# EasyEDA Pro project grandPA2.eprj, schematic Key
Board Name: Key; Create Date: 2026-07-15; Page Name: P1; Project Name: grandPA2; Schematic Name: Key; Update Date: 2026-07-20; Company: EasyEDA.com; Page Size: A4; Version: v0.2
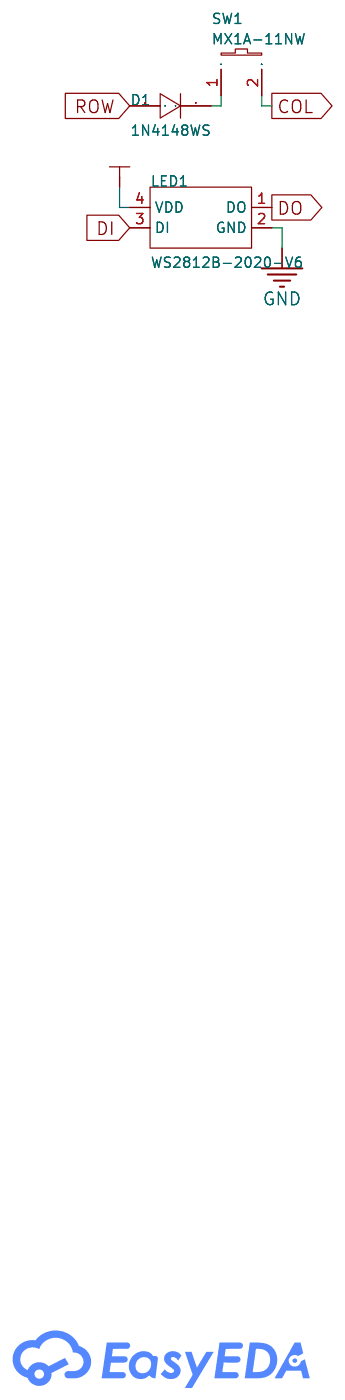
[diagram p1: schematic sheet]

## Parts
D1  1N4148WS  [SOD-323_L1.8-W1.3-LS2.5-RD]
LED1  WS2812B-2020-V6  [LED-SMD_4P-L2.2-W2.0-P1.00_WS2815C-2020-4P]
SW1  MX1A-11NW  [SW-TH_MX1A-11NW]

## Library data of the parts
D1 = 1N4148WS_C2128: LCSC Part Name: 丝印T4 100V 150mA; Supplier Part: C2128; Manufacturer: CJ(江苏长电/长晶); Supplier Footprint: SOD-323; JLCPCB Part Class: Basic Part; Datasheet: https://item.szlcsc.com/datasheet/1N4148WS/2485.html; Supplier: LCSC; Diode Configuration: Standalone; Pd - Power Dissipation: 200mW; Current - Rectified: 150mA; Voltage - DC Reverse(Vr): 100V; Voltage - Forward(Vf@If): 1.25V@150mA; Non-Repetitive Peak Forward Surge Current: 2A; Reverse Leakage Current (Ir): 1uA@75V; Reverse Recovery Time (trr): 4ns
LED1 = WS2812B-2020-V6: Supplier Part: C52917434; Manufacturer: worldsemi; Supplier Footprint: SMD2020-4P; JLCPCB Part Class: Extended Part; Datasheet: https://item.szlcsc.com/datasheet/WS2812B-2020-V6/55827425.html; Supplier: LCSC
SW1 = MX1A-11NW: Supplier Part: C3316924; Manufacturer: CHERRY; JLCPCB Part Class: Extended Part; Datasheet: https://item.szlcsc.com/datasheet/MX1A-11NW/3881518.html; Supplier: LCSC

## Nets
5V: LED1.4(VDD)
GND: LED1.2(GND)
COL: SW1.2
DI: LED1.3(DI)
DO: LED1.1(DO)
ROW: D1.2(A)
$1N2306: D1.1(K) SW1.1
